# EAGLE schematic Memory-4k (EAGLE 6.6.0)
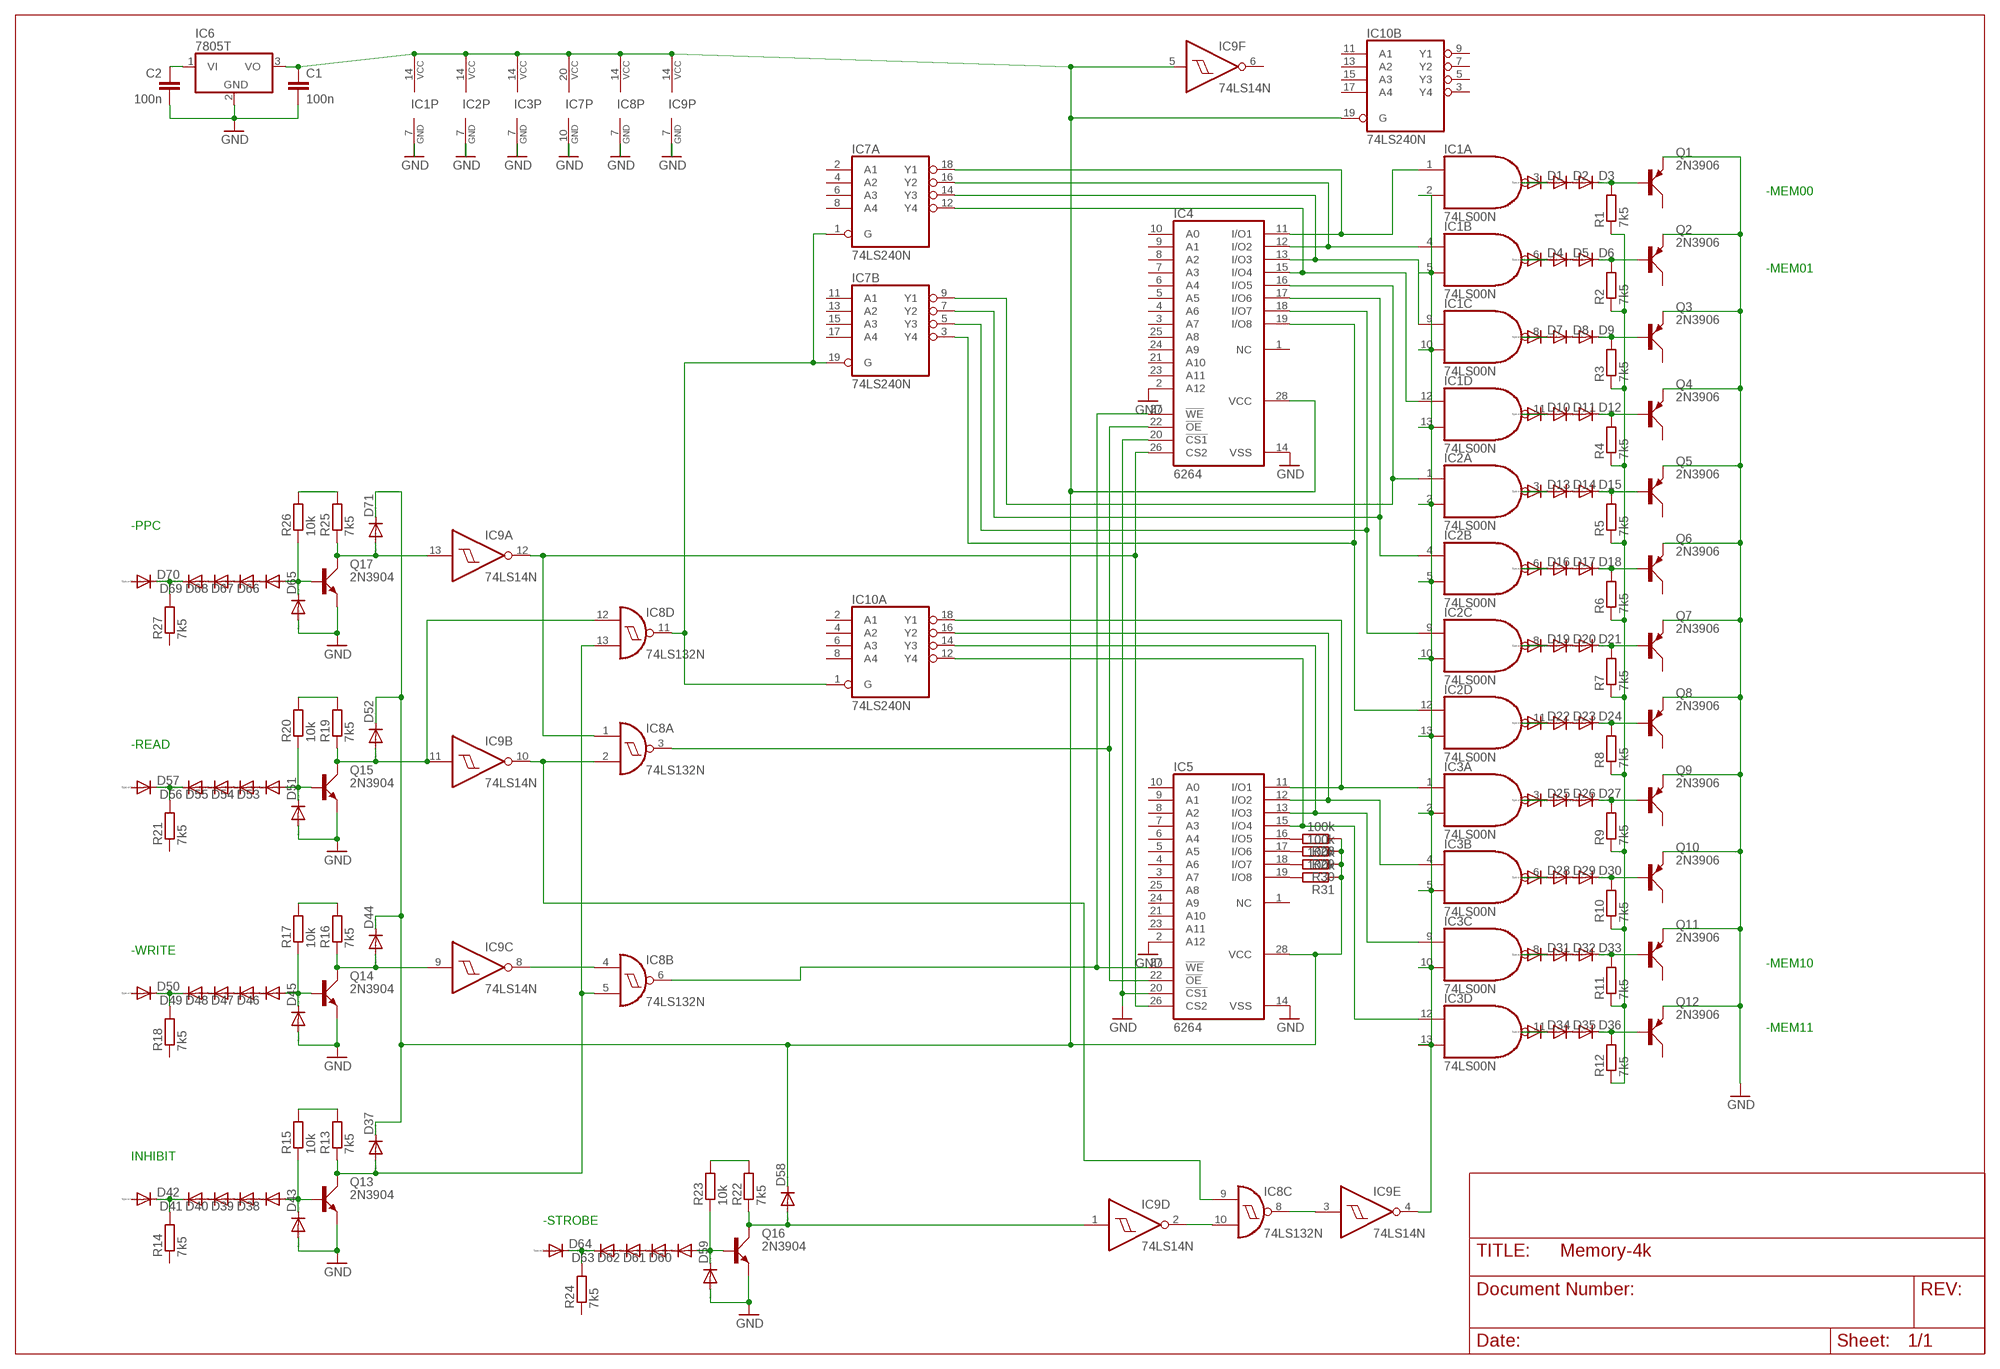
[diagram p0: schematic, sheet 1]

## Parts
C1  100n  C-EU050-024X044  [C050-024X044]
C2  100n  C-EU050-024X044  [C050-024X044]
D1  DIODE-D-7.5  [D-7.5]
D2  DIODE-D-7.5  [D-7.5]
D3  DIODE-D-7.5  [D-7.5]
D4  DIODE-D-7.5  [D-7.5]
D5  DIODE-D-7.5  [D-7.5]
D6  DIODE-D-7.5  [D-7.5]
D7  DIODE-D-7.5  [D-7.5]
D8  DIODE-D-7.5  [D-7.5]
D9  DIODE-D-7.5  [D-7.5]
D10  DIODE-D-7.5  [D-7.5]
D11  DIODE-D-7.5  [D-7.5]
D12  DIODE-D-7.5  [D-7.5]
D13  DIODE-D-7.5  [D-7.5]
D14  DIODE-D-7.5  [D-7.5]
D15  DIODE-D-7.5  [D-7.5]
D16  DIODE-D-7.5  [D-7.5]
D17  DIODE-D-7.5  [D-7.5]
D18  DIODE-D-7.5  [D-7.5]
D19  DIODE-D-7.5  [D-7.5]
D20  DIODE-D-7.5  [D-7.5]
D21  DIODE-D-7.5  [D-7.5]
D22  DIODE-D-7.5  [D-7.5]
D23  DIODE-D-7.5  [D-7.5]
D24  DIODE-D-7.5  [D-7.5]
D25  DIODE-D-7.5  [D-7.5]
D26  DIODE-D-7.5  [D-7.5]
D27  DIODE-D-7.5  [D-7.5]
D28  DIODE-D-7.5  [D-7.5]
D29  DIODE-D-7.5  [D-7.5]
D30  DIODE-D-7.5  [D-7.5]
D31  DIODE-D-7.5  [D-7.5]
D32  DIODE-D-7.5  [D-7.5]
D33  DIODE-D-7.5  [D-7.5]
D34  DIODE-D-7.5  [D-7.5]
D35  DIODE-D-7.5  [D-7.5]
D36  DIODE-D-7.5  [D-7.5]
D37  DIODE-D-7.5  [D-7.5]
D38  DIODE-D-7.5  [D-7.5]
D39  DIODE-D-7.5  [D-7.5]
D40  DIODE-D-7.5  [D-7.5]
D41  DIODE-D-7.5  [D-7.5]
D42  DIODE-D-7.5  [D-7.5]
D43  DIODE-D-7.5  [D-7.5]
D44  DIODE-D-7.5  [D-7.5]
D45  DIODE-D-7.5  [D-7.5]
D46  DIODE-D-7.5  [D-7.5]
D47  DIODE-D-7.5  [D-7.5]
D48  DIODE-D-7.5  [D-7.5]
D49  DIODE-D-7.5  [D-7.5]
D50  DIODE-D-7.5  [D-7.5]
D51  DIODE-D-7.5  [D-7.5]
D52  DIODE-D-7.5  [D-7.5]
D53  DIODE-D-7.5  [D-7.5]
D54  DIODE-D-7.5  [D-7.5]
D55  DIODE-D-7.5  [D-7.5]
D56  DIODE-D-7.5  [D-7.5]
D57  DIODE-D-7.5  [D-7.5]
D58  DIODE-D-7.5  [D-7.5]
D59  DIODE-D-7.5  [D-7.5]
D60  DIODE-D-7.5  [D-7.5]
D61  DIODE-D-7.5  [D-7.5]
D62  DIODE-D-7.5  [D-7.5]
D63  DIODE-D-7.5  [D-7.5]
D64  DIODE-D-7.5  [D-7.5]
D65  DIODE-D-7.5  [D-7.5]
D66  DIODE-D-7.5  [D-7.5]
D67  DIODE-D-7.5  [D-7.5]
D68  DIODE-D-7.5  [D-7.5]
D69  DIODE-D-7.5  [D-7.5]
D70  DIODE-D-7.5  [D-7.5]
D71  DIODE-D-7.5  [D-7.5]
IC1  74LS00N  [DIL14]
IC2  74LS00N  [DIL14]
IC3  74LS00N  [DIL14]
IC4  6264  6264A  [DIL28-6]
IC5  6264  6264A  [DIL28-6]
IC6  7805T  [TO220H]
IC7  74LS240N  [DIL20]
IC8  74LS132N  [DIL14]
IC9  74LS14N  [DIL14]
IC10  74LS240N  [DIL20]
Q1  2N3906  [TO92D]
Q2  2N3906  [TO92D]
Q3  2N3906  [TO92D]
Q4  2N3906  [TO92D]
Q5  2N3906  [TO92D]
Q6  2N3906  [TO92D]
Q7  2N3906  [TO92D]
Q8  2N3906  [TO92D]
Q9  2N3906  [TO92D]
Q10  2N3906  [TO92D]
Q11  2N3906  [TO92D]
Q12  2N3906  [TO92D]
Q13  2N3904  [TO92D]
Q14  2N3904  [TO92D]
Q15  2N3904  [TO92D]
Q16  2N3904  [TO92D]
Q17  2N3904  [TO92D]
R1  7k5  R-EU_0204/7  [0204/7]
R2  7k5  R-EU_0204/7  [0204/7]
R3  7k5  R-EU_0204/7  [0204/7]
R4  7k5  R-EU_0204/7  [0204/7]
R5  7k5  R-EU_0204/7  [0204/7]
R6  7k5  R-EU_0204/7  [0204/7]
R7  7k5  R-EU_0204/7  [0204/7]
R8  7k5  R-EU_0204/7  [0204/7]
R9  7k5  R-EU_0204/7  [0204/7]
R10  7k5  R-EU_0204/7  [0204/7]
R11  7k5  R-EU_0204/7  [0204/7]
R12  7k5  R-EU_0204/7  [0204/7]
R13  7k5  R-EU_0204/7  [0204/7]
R14  7k5  R-EU_0204/7  [0204/7]
R15  10k  R-EU_0204/7  [0204/7]
R16  7k5  R-EU_0204/7  [0204/7]
R17  10k  R-EU_0204/7  [0204/7]
R18  7k5  R-EU_0204/7  [0204/7]
R19  7k5  R-EU_0204/7  [0204/7]
R20  10k  R-EU_0204/7  [0204/7]
R21  7k5  R-EU_0204/7  [0204/7]
R22  7k5  R-EU_0204/7  [0204/7]
R23  10k  R-EU_0204/7  [0204/7]
R24  7k5  R-EU_0204/7  [0204/7]
R25  7k5  R-EU_0204/7  [0204/7]
R26  10k  R-EU_0204/7  [0204/7]
R27  7k5  R-EU_0204/7  [0204/7]
R28  100k  R-EU_0204/7  [0204/7]
R29  100k  R-EU_0204/7  [0204/7]
R30  100k  R-EU_0204/7  [0204/7]
R31  100k  R-EU_0204/7  [0204/7]

## Nets
GND: C1.2 C2.2 D43.A D45.A D51.A D59.A D65.A IC1.7(P:GND) IC2.7(P:GND) IC3.7(P:GND) IC4.2(A12) IC4.14(VSS) IC4.20(!CS1) IC5.2(A12) IC5.14(VSS) IC5.20(!CS1) IC6.2(GND) IC7.10(P:GND) IC8.7(P:GND) IC9.7(P:GND) Q1.E Q2.E Q3.E Q4.E Q5.E Q6.E Q7.E Q8.E Q9.E Q10.E Q11.E Q12.E Q13.E Q14.E Q15.E Q16.E Q17.E
N$1: IC1.2(A:I1) IC1.5(B:I1) IC1.10(C:I1) IC1.13(D:I1) IC2.2(A:I1) IC2.5(B:I1) IC2.10(C:I1) IC2.13(D:I1) IC3.2(A:I1) IC3.5(B:I1) IC3.10(C:I1) IC3.13(D:I1) IC9.4(E:O)
N$2: D1.A IC1.3(A:O)
N$3: D1.C D2.A
N$4: D2.C D3.A
N$5: D4.A IC1.6(B:O)
N$6: D4.C D5.A
N$7: D5.C D6.A
N$8: D7.A IC1.8(C:O)
N$9: D7.C D8.A
N$10: D8.C D9.A
N$11: D10.A IC1.11(D:O)
N$12: D10.C D11.A
N$13: D11.C D12.A
N$14: D13.A IC2.3(A:O)
N$15: D13.C D14.A
N$16: D14.C D15.A
N$17: D16.A IC2.6(B:O)
N$18: D16.C D17.A
N$19: D17.C D18.A
N$20: D19.A IC2.8(C:O)
N$21: D19.C D20.A
N$22: D20.C D21.A
N$23: D22.A IC2.11(D:O)
N$24: D22.C D23.A
N$25: D23.C D24.A
N$26: D25.A IC3.3(A:O)
N$27: D25.C D26.A
N$28: D26.C D27.A
N$29: D28.A IC3.6(B:O)
N$30: D28.C D29.A
N$31: D29.C D30.A
N$32: D31.A IC3.8(C:O)
N$33: D31.C D32.A
N$34: D32.C D33.A
N$35: D34.A IC3.11(D:O)
N$36: D34.C D35.A
N$37: D35.C D36.A
N$38: D3.C Q1.B R1.2
N$39: D6.C Q2.B R2.2
N$40: D9.C Q3.B R3.2
N$41: D12.C Q4.B R4.2
N$42: D15.C Q5.B R5.2
N$43: D18.C Q6.B R6.2
N$44: D21.C Q7.B R7.2
N$45: D24.C Q8.B R8.2
N$46: D27.C Q9.B R9.2
N$47: D30.C Q10.B R10.2
N$48: D33.C Q11.B R11.2
N$49: D36.C Q12.B R12.2
N$50: IC3.9(C:I0) IC5.13(I/O3) IC10.14(A:Y3)
N$56: IC5.16(I/O5) R28.2
N$57: IC5.17(I/O6) R29.2
N$58: IC5.18(I/O7) R30.2
N$59: IC5.19(I/O8) R31.2
N$61: R1.1 R2.1 R3.1 R4.1 R5.1 R6.1 R7.1 R8.1 R9.1 R10.1 R11.1 R12.1
N$62: IC1.1(A:I0) IC4.11(I/O1) IC7.18(A:Y1)
N$63: IC1.4(B:I0) IC4.12(I/O2) IC7.16(A:Y2)
N$64: IC1.9(C:I0) IC4.13(I/O3) IC7.14(A:Y3)
N$65: IC1.12(D:I0) IC4.15(I/O4) IC7.12(A:Y4)
N$66: IC2.1(A:I0) IC4.16(I/O5) IC7.9(B:Y1)
N$67: IC2.4(B:I0) IC4.17(I/O6) IC7.7(B:Y2)
N$68: IC2.9(C:I0) IC4.18(I/O7) IC7.5(B:Y3)
N$69: IC2.12(D:I0) IC4.19(I/O8) IC7.3(B:Y4)
N$70: IC3.1(A:I0) IC5.11(I/O1) IC10.18(A:Y1)
N$71: IC3.4(B:I0) IC5.12(I/O2) IC10.16(A:Y2)
N$73: IC3.12(D:I0) IC5.15(I/O4) IC10.12(A:Y4)
N$74: IC8.10(C:I1) IC9.2(D:O)
N$75: IC8.2(A:I1) IC8.9(C:I0) IC9.10(B:O)
N$76: IC4.22(!OE) IC5.22(!OE) IC8.3(A:O)
N$77: IC4.27(!WE) IC5.27(!WE) IC8.6(B:O)
N$78: D38.C D39.A
N$79: D39.C D40.A
N$80: D40.C D41.A
N$81: D41.C D42.C R14.2
N$82: D38.A D43.C Q13.B R15.1
N$83: D37.A IC8.5(B:I1) IC8.13(D:I1) Q13.C R13.1
N$84: IC8.4(B:I0) IC9.8(C:O)
N$85: C2.1 IC6.1(VI)
N$86: IC8.8(C:O) IC9.3(E:I)
N$87: D60.C D61.A
N$88: D46.C D47.A
N$89: D47.C D48.A
N$90: D48.C D49.A
N$91: D44.A IC9.9(C:I) Q14.C R16.1
N$92: D61.C D62.A
N$93: D45.C D46.A Q14.B R17.1
N$94: D49.C D50.C R18.2
N$95: D62.C D63.A
N$96: R16.2 R17.2
N$97: R13.2 R15.2
N$98: D53.C D54.A
N$99: D54.C D55.A
N$100: D55.C D56.A
N$101: IC7.1(A:G) IC7.19(B:G) IC8.11(D:O) IC10.1(A:G)
N$102: D51.C D53.A Q15.B R20.1
N$103: D59.C D60.A Q16.B R23.1
N$104: D52.A IC8.12(D:I0) IC9.11(B:I) Q15.C R19.1
N$105: D56.C D57.C R21.2
N$106: R19.2 R20.2
N$107: R22.2 R23.2
N$108: D58.A IC9.1(D:I) Q16.C R22.1
N$109: D63.C D64.C R24.2
N$110: C1.1 D37.C D44.C D52.C D58.C D71.C IC1.14(P:VCC) IC2.14(P:VCC) IC3.14(P:VCC) IC4.28(VCC) IC5.28(VCC) IC6.3(VO) IC7.20(P:VCC) IC8.14(P:VCC) IC9.14(P:VCC) IC10.19(B:G) R28.1 R29.1 R30.1 R31.1
N$114: D66.C D67.A
N$115: D67.C D68.A
N$116: D68.C D69.A
N$119: D65.C D66.A Q17.B R26.1
N$120: D71.A IC9.13(A:I) Q17.C R25.1
N$121: R25.2 R26.2
N$122: D69.C D70.C R27.2
N$124: IC4.26(CS2) IC5.26(CS2) IC8.1(A:I0) IC9.12(A:O)
Unconnected: D42.A D50.A D57.A D64.A D70.A IC4.1(NC) IC4.3(A7) IC4.4(A6) IC4.5(A5) IC4.6(A4) IC4.7(A3) IC4.8(A2) IC4.9(A1) IC4.10(A0) IC4.21(A10) IC4.23(A11) IC4.24(A9) IC4.25(A8) IC5.1(NC) IC5.3(A7) IC5.4(A6) IC5.5(A5) IC5.6(A4) IC5.7(A3) IC5.8(A2) IC5.9(A1) IC5.10(A0) IC5.21(A10) IC5.23(A11) IC5.24(A9) IC5.25(A8) IC7.2(A:A1) IC7.4(A:A2) IC7.6(A:A3) IC7.8(A:A4) IC7.11(B:A1) IC7.13(B:A2) IC7.15(B:A3) IC7.17(B:A4) IC9.5(F:I) IC9.6(F:O) IC10.2(A:A1) IC10.3(B:Y4) IC10.4(A:A2) IC10.5(B:Y3) IC10.6(A:A3) IC10.7(B:Y2) IC10.8(A:A4) IC10.9(B:Y1) IC10.11(B:A1) IC10.13(B:A2) IC10.15(B:A3) IC10.17(B:A4) Q1.C Q2.C Q3.C Q4.C Q5.C Q6.C Q7.C Q8.C Q9.C Q10.C Q11.C Q12.C R14.1 R18.1 R21.1 R24.1 R27.1

## Notes on the sheet
- -MEM00
- -MEM01
- -PPC
- -READ
- -WRITE
- -MEM10
- -MEM11
- INHIBIT
- -STROBE

## Power pins joined to a net without a drawn wire
GND: IC10.10(P:GND)
VCC: IC10.20(P:VCC)

## Library data of the parts
C1 C2 = rcl:C-EU: CAPACITOR, European symbol
D1-D71 = diode:DIODE-: DIODE
IC1-IC3 = 74xx-us:74*00: Quad 2-input NAND gate
IC4 IC5 = memory-hitachi:6264A: MEMORY; OC_FARNELL: 283605; OC_NEWARK: unknown
IC6 = linear:78*: Positive VOLTAGE REGULATOR Source: http://cache.national.com/ds/LM/LM78L05.pdf http://www.fairchildsemi.com/ds/LM/LM7805.pdf
IC7 IC10 = 74xx-us:74*240: Octal BUFFER and LINE DRIVER, 3-state
IC8 = 74xx-us:74*132: Quad 2-input NAND schmitt trigger
IC9 = 74xx-us:74*14: Hex schmitt trigger INVERTER
Q1-Q12 = transistor-small-signal:2N3906: PNP TRANSISTOR
Q13-Q17 = transistor-small-signal:2N3904: NPN TRANSISTOR
R1-R31 = rcl:R-EU_: RESISTOR, European symbol